# Altium schematic sheet CAN.SchDoc: CAN
size B; Organization: Myomo; Address1: 137 PORTLAND STREET, 4TH FLOOR; Address2: BOSTON, MA 02114; Address3: USA; SheetNumber: 7
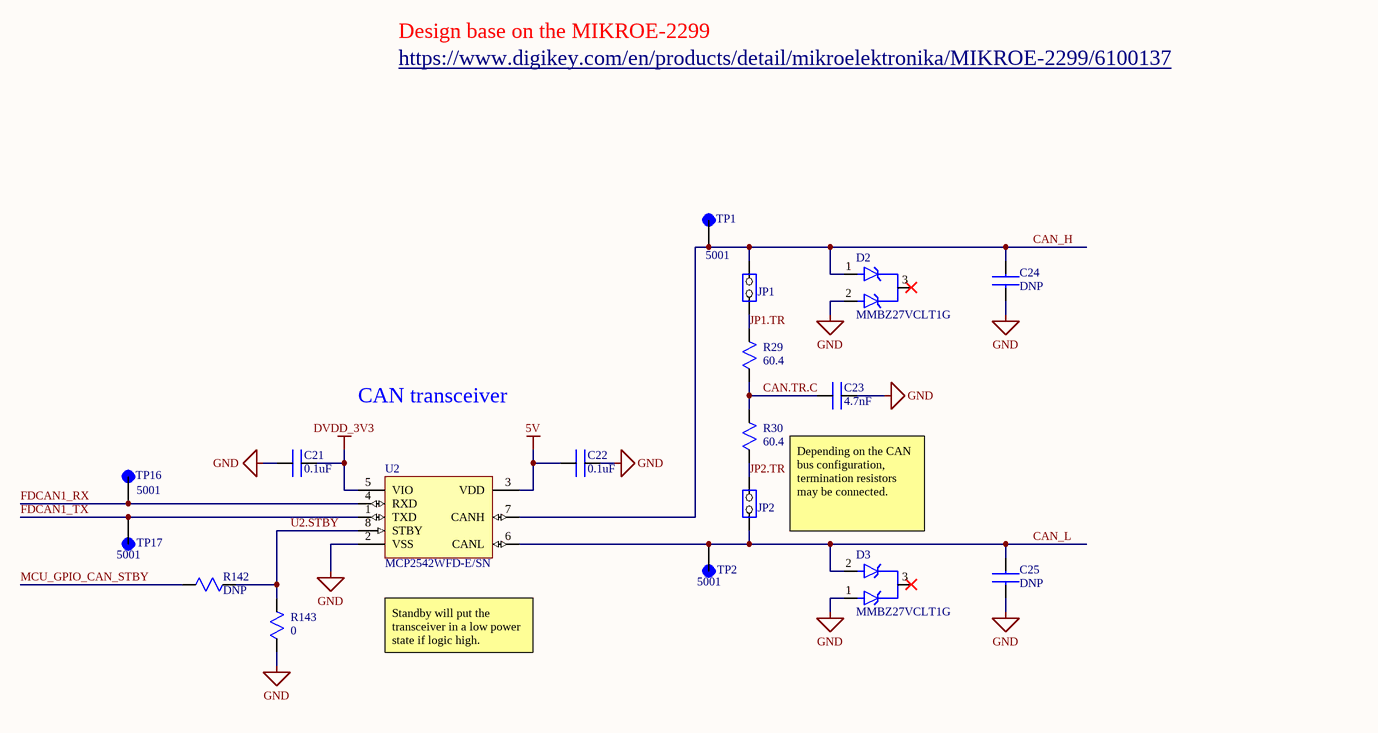
[diagram p0: CAN.SchDoc]

## Parts
C21  0.1uF  [0603]
C22  0.1uF  [0603]
C23  4.7nF  [0603]
C24  DNP  [0603]  (no BOM)
C25  DNP  [0603]  (no BOM)
D2  MMBZ27VCLT1G  [D_TVS_38V_40W]
D3  MMBZ27VCLT1G  [D_TVS_38V_40W]
JP1  JP_1x2_TSW-102-07-F-S  [JP_1x2_TSW-102-07-F-S]  (value not drawn)
JP2  JP_1x2_TSW-102-07-F-S  [JP_1x2_TSW-102-07-F-S]  (value not drawn)
R29  60.4  [0603]
R30  60.4  [0603]
R142  DNP  [0402]  (no BOM)
R143  0  [0402]
TP1  5001  [TP_CLIP_BLK_5001]
TP2  5001  [TP_CLIP_BLK_5001]
TP16  5001  [TP_CLIP_BLK_5001]
TP17  5001  [TP_CLIP_BLK_5001]
U2  MCP2542WFD-E/SN  [U_MCP2542WFD-E/SN]

## Nets
5V: C22.1 U2.3(VDD)
DVDD_3V3: C21.2 U2.5(VIO)
GND: C21.1 C22.2 C23.2 C24.2 C25.2 D2.2(A2) D3.1(A1) R143.2 U2.2(VSS)
CAN.TR.C: C23.1 R29.2 R30.1
CAN_H: C24.1 D2.1(A1) JP1.1 TP1.TP U2.7(CANH)
CAN_L: C25.1 D3.2(A2) JP2.1 TP2.TP U2.6(CANL)
FDCAN1_RX: TP16.TP U2.4(RXD)
FDCAN1_TX: TP17.TP U2.1(TXD)
JP1.TR: JP1.2 R29.1
JP2.TR: JP2.2 R30.2
MCU_GPIO_CAN_STBY: R142.1
U2.STBY: R142.2 R143.1 U2.8(STBY)

Not connected (* = marked no-connect by the designer): D2 3(K)*; D3 3(K)*

## Notes on the sheet
- Design base on the MIKROE-2299
- https://www.digikey.com/en/products/detail/mikroelektronika/MIKROE-2299/6100137
- CAN transceiver
- Depending on the CAN bus configuration, termination resistors  may be connected.
- Standby will put the transceiver in a low power state if logic high.
- TITLE:
- NAME
- DATE
- PCA REVISION:
- PCA NAME:
- APPROVED BY:
- DESIGNED BY:
- PCA NUMBER:
- DATE:
- TIME:
- DOCUMENT SIZE:
- SHEET:
- OF
- B
- PROPRIETARY AND CONFIDENTIAL
  THIS DOCUMENT AND THE DATA CONTAINED HEREIN OR HEREWITH IS NOT TO BE REPRODUCED, USED, OR DISCLOSED, IN WHOLE OR IN PART, WITHOUT THE PERMISSION OF
  MYOMO, INC.

## Library data of the parts
C21 C22 = C_0603_CER_0.1uF_100V_X7R: CAP CER 0.1UF 100V X7R 0603; MFG: SAMSUNG; MFGPN: CL10B104KC8NNNC; Myomo PN: 201-0005
C23 = C_0603_CER_4.7nF_100V_X7R: CAP CER 4700PF 100V X7R 0603; MFG: SAMSUNG; MFGPN: CL10B472KC8WPNC; Myomo PN: 201-0010
C24 C25 = C_0603_DNP: CAP CER 0603 DNP
D2 D3 = D_TVS_38V_40W: TVS DIODE 22VWM 38VC SOT23-3; MFG: Onsemi; Myomo PN: 203-0002; MFGPN: MMBZ27VCLT1G
JP1 JP2 = JP_1x2_TSW-102-07-F-S: CONN HEADER VERT 2POS 2.54MM; MFG: SAMTEC; Myomo PN: 214-0001; MFGPN: TSW-102-07-F-S
R29 R30 = R_0603_60.4_1%_1/10W: RES 60.4 OHM 1% 1/10W 0603; MFG: YAGEO; MFGPN: RC0603FR-0760R4L; Myomo PN: 200-0008
R142 = R_0402_DNP: RES 0402 DNP
R143 = R_0402_0: RES 0 OHM JUMPER 1/10W 0402; MFG: YAGEO; MFGPN: RC0402FR-070RL; Myomo PN: 200-0018
TP1 TP2 TP16 TP17 = TP_CLIP_BLK_5001: PC TEST POINT MINIATURE BLACK; MFG: Keystone Electronics; Myomo PN: 213-0001; MFGPN: 5001
U2 = U_MCP2542WFD-E/SN: IC CAN TRANSCEIVER 1/1 8SOIC; MFG: Microchip; Myomo PN: 204-0001; MFGPN: MCP2542WFD-E/SN; Supplier 1: DigiKey; Supplier Part Number 1: MCP2542WFD-E/SN-ND